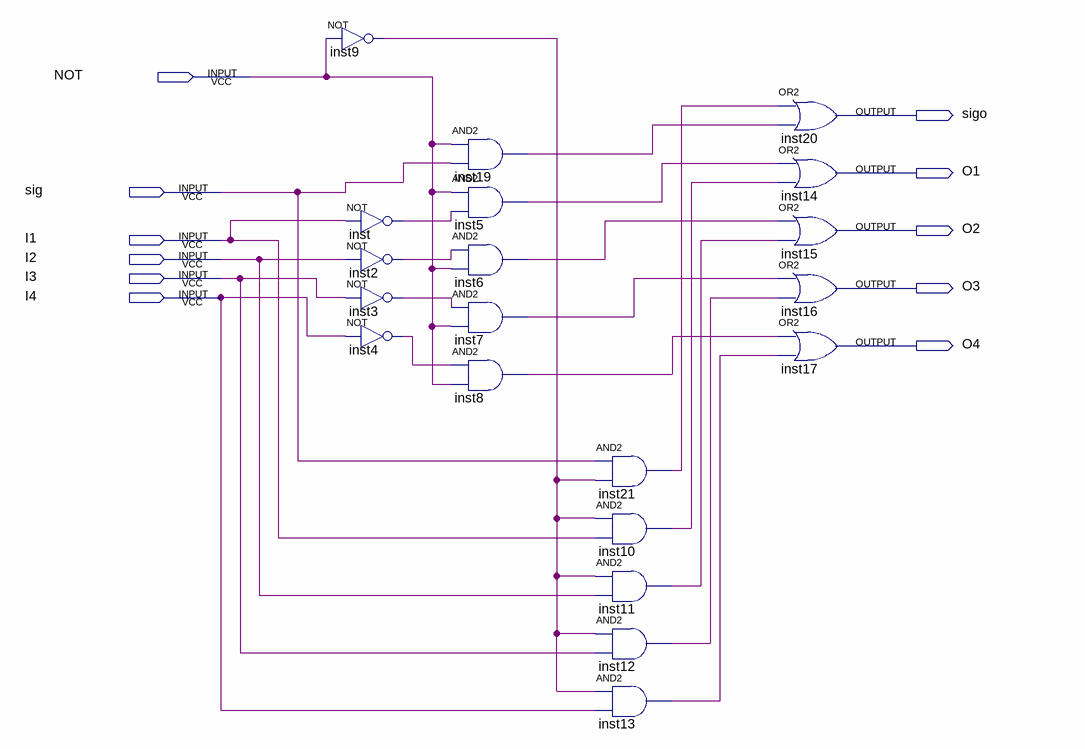
[diagram p0: schematic sheet]
// Quartus schematic inot.bdf as structural Verilog: 20 symbols, 11 pins
module inot (
  input  NOT,
  input  sig,
  input  I1,
  input  I2,
  input  I3,
  input  I4,
  output sigo,
  output O1,
  output O2,
  output O3,
  output O4
);

  wire inst2_out, inst3_out, inst4_out, inst5_out, inst6_out, inst7_out, inst8_out, inst9_out, inst10_out,
       inst11_out, inst12_out, inst13_out, inst19_out, inst21_out, inst_out;

  not inst9 (inst9_out, NOT);
  not inst (inst_out, I1);
  not inst2 (inst2_out, I2);
  not inst3 (inst3_out, I3);
  not inst4 (inst4_out, I4);
  and inst19 (inst19_out, NOT, sig);
  and inst5 (inst5_out, NOT, inst_out);
  and inst6 (inst6_out, inst2_out, NOT);
  and inst7 (inst7_out, inst3_out, NOT);
  and inst8 (inst8_out, inst4_out, NOT);
  and inst21 (inst21_out, sig, inst9_out);
  and inst10 (inst10_out, inst9_out, I1);
  and inst11 (inst11_out, inst9_out, I2);
  and inst12 (inst12_out, inst9_out, I3);
  and inst13 (inst13_out, inst9_out, I4);
  or inst20 (sigo, inst21_out, inst19_out);
  or inst14 (O1, inst5_out, inst10_out);
  or inst15 (O2, inst6_out, inst11_out);
  or inst16 (O3, inst7_out, inst12_out);
  or inst17 (O4, inst8_out, inst13_out);
endmodule
